# Altium schematic sheet TLM_002_SD.SchDoc: =DocumentName
size A4; CompanyName: Scopa Industries LLC; Engineer: Nazar Lysenko / Andrii Antonenko; Organization: Scopa Industries LLC; Address1: Kyiv; Address2: Ukraine; Address3: https://www.scopa.industries/; Address4: oleksyi.y@scopa.industries; SheetNumber: 6; SheetTotal: 11
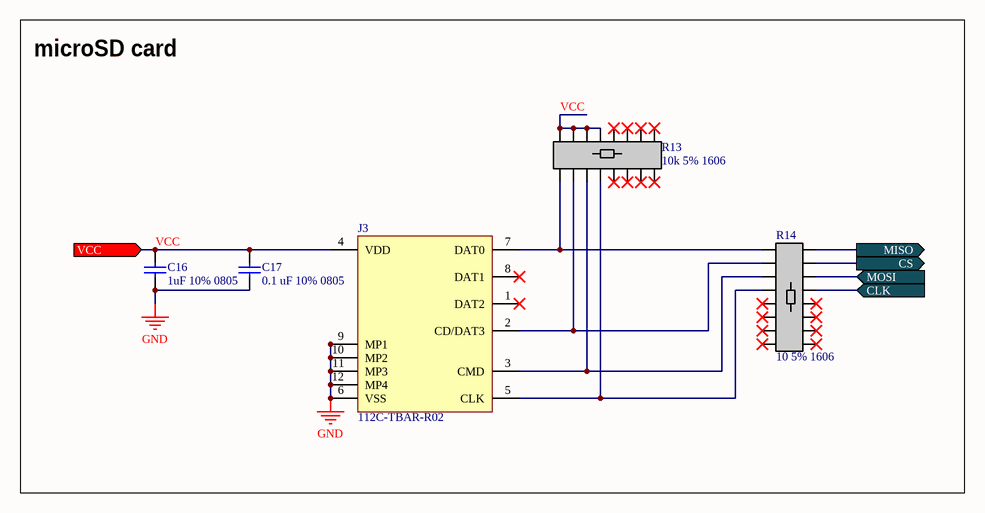
[diagram p0: TLM_002_SD.SchDoc]

## Parts
C16  1uF 10% 0805  [CAPC2013X145X50NL20T20]
C17  0.1 uF 10% 0805  [CAPC2013X140X50ML20T25]
J3  112C-TBAR-R02  [112CTBARR02]
R13  10k 5% 1606  [RES Array]
R14  10 5% 1606  [RES Array]

## Ports
CLK (in, see TLM_002_MBR[2C], TLM_002_CONNECT[1B], TLM_002_ESP32S3[2B], TLM_002_MAX6675[2B], TLM_002_MAX31856[2B]), CS (out, see TLM_002_MBR[2C]), MISO (out, see TLM_002_MBR[2B], TLM_002_CONNECT[1A], TLM_002_ESP32S3[3B], TLM_002_MAX6675[2B], TLM_002_MAX31856[2B]), MOSI (in, see TLM_002_MBR[2C], TLM_002_CONNECT[1A], TLM_002_ESP32S3[2B], TLM_002_MAX31856[2B]), VCC (in, see TLM_002_MBR[2B], TLM_002_DS3231SN_RTC[2B], TLM_002_ESP32S3[1A], TLM_002_INA228[1B], TLM_002_LoRa[2B], TLM_002_MAX6675[2B], TLM_002_MAX31856[1B], TLM_002_MCP3021[3B])

## Nets
GND: C16.1 C17.1 J3.6(VSS) J3.9(MP1) J3.10(MP2) J3.11(MP3) J3.12(MP4)
CLK: R14.13 ; port CLK
CS: R14.15 ; port CS
MISO: R14.16 ; port MISO
MOSI: R14.14 ; port MOSI
VCC: C16.2 C17.2 J3.4(VDD) R13.13 R13.14 R13.15 R13.16 ; port VCC
NetJ3_2: J3.2(CD/DAT3) R13.2 R14.2
NetJ3_3: J3.3(CMD) R13.3 R14.3
NetJ3_5: J3.5(CLK) R13.4 R14.4
NetJ3_7: J3.7(DAT0) R13.1 R14.1

Not connected (* = marked no-connect by the designer): J3 1(DAT2)* 8(DAT1)*; R13 5* 6* 7* 8* 9* 10* 11* 12*; R14 5* 6* 7* 8* 9* 10* 11* 12*

## Notes on the sheet
- microSD card
- Title
- Size:
- Date:
- A4
- Author:
- Time:
- Sheet
- Revision:
- of
- File:

## Library data of the parts
C16 = CMP-2007-01676-1: Part Number: VJ0805Y105KXQRW1BC; Manufacturer: Vitramon
C17 = CMP-2007-04651-1: Part Number: 0805DD104KAT2A; Manufacturer: AVX Interconnect / Elco
J3 = 112C-TBAR-R02: Connector; Manufacturer_Name: ATTEND; Height: 2.13mm; Manufacturer_Part_Number: 112C-TBAR-R02
R13 = RES_ARRAY_10k
R14 = RES_ARRAY_10